# Altium project 接收机主板.PrjPcb
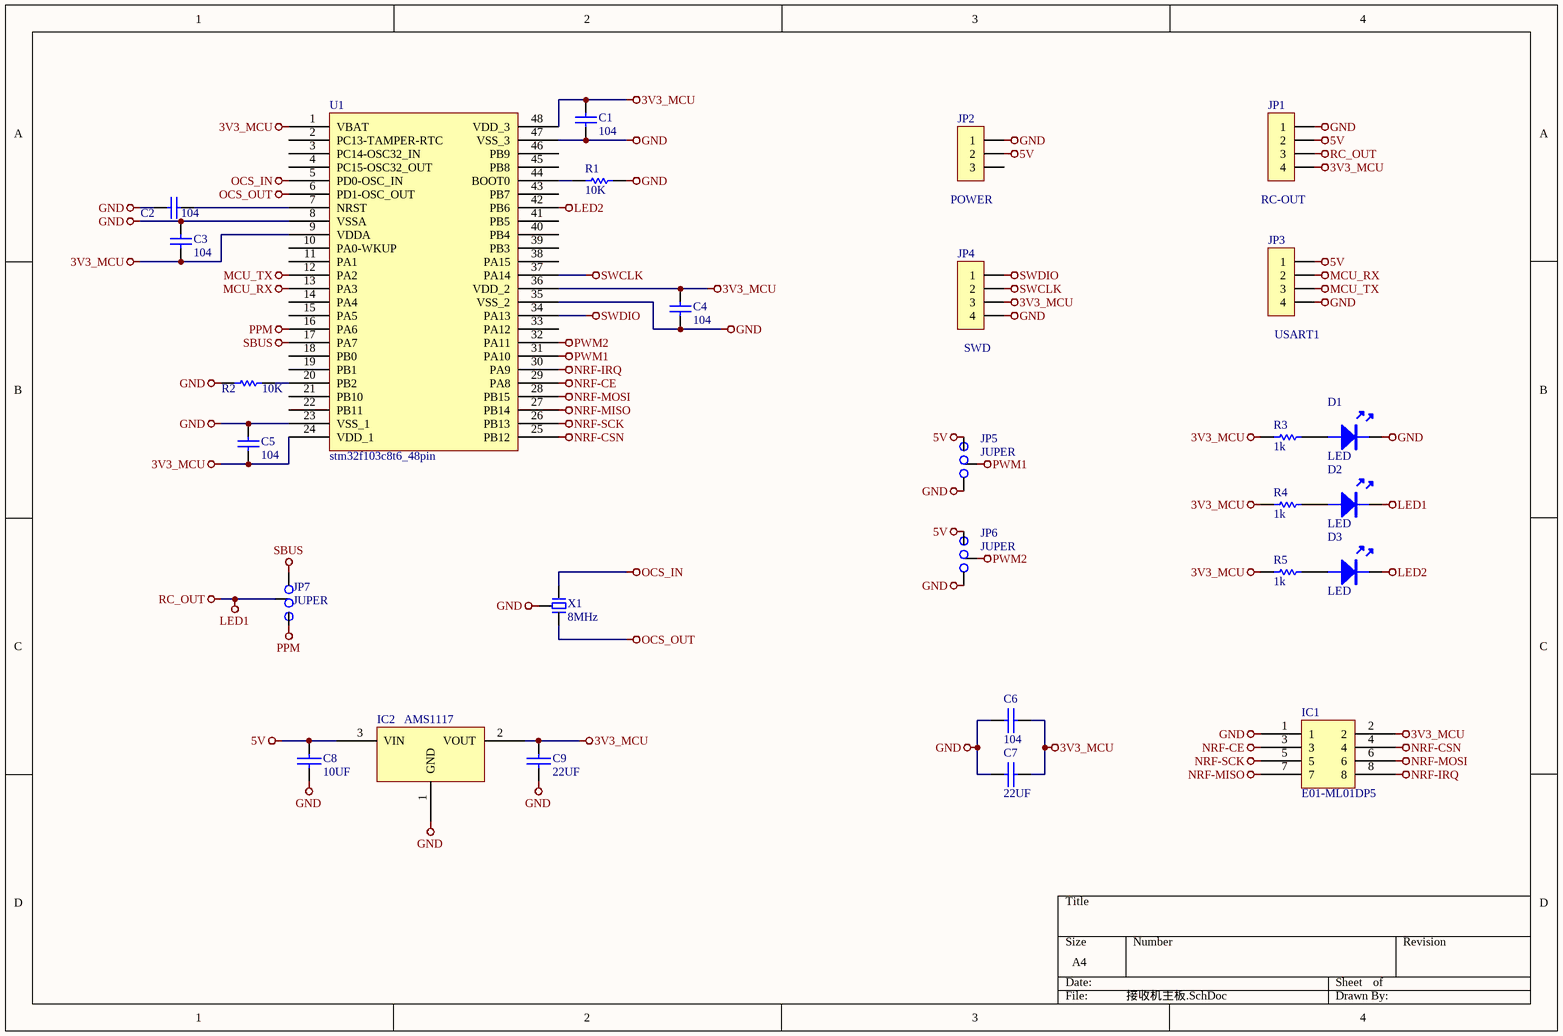
[diagram p0: 接收机主板.SchDoc]
1 sheet, 28 parts. Net scope: global (net labels, ports and power ports of the same name join across sheets).
Board file: 接收机主板.PcbDoc

## Sheet 接收机主板.SchDoc
size A4

### Parts
C1  104  [0603C]
C2  104  [0603C]
C3  104  [0603C]
C4  104  [0603C]
C5  104  [0603C]
C6  104  [0603C]
C7  22UF  [0603C]
C8  10UF  [0603C]
C9  22UF  [0603C]
D1  LED  [LED-0603G]
D2  LED  [LED-0603G]
D3  LED  [LED-0603G]
IC1  E01-ML01DP5  [E01-ML01DP5]
IC2  AMS1117  [AMS1117]
JP1  RC-OUT  [SH1.0 S-W-4P]
JP2  POWER  [MX 1.25-WS-3P]
JP3  USART1  [SH1.0 S-W-4P]
JP4  SWD  [SH1.0 S-W-4P]
JP5  JUPER  [JUMPER 3P]
JP6  JUPER  [JUMPER 3P]
JP7  JUPER  [JUMPER 3P]
R1  10K  [0402R]
R2  10K  [0402R]
R3  1k  [0805R]
R4  1k  [0805R]
R5  1k  [0805R]
U1  stm32f103c8t6_48pin  [LQFP48 7X7]
X1  8MHz  [XTAL-3215-3P]

### Nets
3V3_MCU: C1.2 C3.1 C4.2 C5.1 C6.2 C7.2 C9.2 IC1.2 IC2.2(VOUT) JP1.4 JP4.3 R3.1 R4.1 R5.1 U1.1(VBAT) U1.9(VDDA) U1.24(VDD_1) U1.36(VDD_2) U1.48(VDD_3)
5V: C8.2 IC2.3(VIN) JP1.2 JP2.2 JP3.1 JP5.3 JP6.3
GND: C1.1 C2.2 C3.2 C4.1 C5.2 C6.1 C7.1 C8.1 C9.1 D1.K IC1.1 IC2.1(GND) JP1.1 JP2.1 JP3.4 JP4.4 JP5.1 JP6.1 R1.2 R2.1 U1.8(VSSA) U1.23(VSS_1) U1.35(VSS_2) U1.47(VSS_3) X1.2
LED1: D2.K JP1.3 JP7.2  [also labelled RC_OUT]
LED2: D3.K U1.42(PB6)
MCU_RX: JP3.2 U1.13(PA3)
MCU_TX: JP3.3 U1.12(PA2)
NRF-CE: IC1.3 U1.29(PA8)
NRF-CSN: IC1.4 U1.25(PB12)
NRF-IRQ: IC1.8 U1.30(PA9)
NRF-MISO: IC1.7 U1.27(PB14)
NRF-MOSI: IC1.6 U1.28(PB15)
NRF-SCK: IC1.5 U1.26(PB13)
OCS_IN: U1.5(PD0-OSC_IN) X1.1
OCS_OUT: U1.6(PD1-OSC_OUT) X1.3
PPM: JP7.3 U1.16(PA6)
PWM1: JP5.2 U1.31(PA10)
PWM2: JP6.2 U1.32(PA11)
SBUS: JP7.1 U1.17(PA7)
SWCLK: JP4.2 U1.37(PA14)
SWDIO: JP4.1 U1.34(PA13)
NetC2_1: C2.1 U1.7(NRST)
NetD1_A: D1.A R3.2
NetD2_A: D2.A R4.2
NetD3_A: D3.A R5.2
NetR1_1: R1.1 U1.44(BOOT0)
NetR2_2: R2.2 U1.20(PB2)

Not connected (* = marked no-connect by the designer): JP2 3; U1 2(PC13-TAMPER-RTC) 3(PC14-OSC32_IN) 4(PC15-OSC32_OUT) 10(PA0-WKUP) 11(PA1) 14(PA4) 15(PA5) 18(PB0) 19(PB1) 21(PB10) 22(PB11) 33(PA12) 38(PA15) 39(PB3) 40(PB4) 41(PB5) 43(PB7) 45(PB8) 46(PB9)

### Library data of the parts
C1-C5 = Cap: Published: 8-Jun-2000; LatestRevisionDate: 17-Jul-2002; LatestRevisionNote: Re-released for DXP Platform.; Publisher: Altium Limited; Value: 104
C6-C9 = CAP: 无极性电容
IC1 = E01-ML01DP5: 2.4G无线模块
IC2 = AMS1117: 3V3降压芯片
JP1 JP3 JP4 = Header 4: 4P接插件; 版权归属: 源创客; BOM名称: 4P接插件; 学习资源: www.ooocke.com
JP2 = Header 3: 3P接插件; 版权归属: 源创客; BOM名称: 3P接插件; 学习资源: www.ooocke.com
JP5-JP7 = JUMPER 3P: 三点焊盘跳线
R1-R5 = RES
X1 = XTAL-3P: 3脚无源晶振; BOM名称: 2脚晶振; 版权归属: 源创客; 学习资源: www.ooocke.com